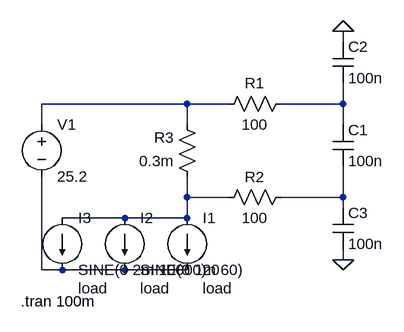
[diagram p0: schematic Draft1.asc]
Draft1.asc, the LTspice schematic file:
Version 4.1
SHEET 1 880 680
WIRE 256 0 256 -16
WIRE 16 96 -208 96
WIRE 80 96 16 96
WIRE 256 96 256 64
WIRE 256 96 160 96
WIRE -208 128 -208 96
WIRE 16 128 16 96
WIRE 256 128 256 96
WIRE 16 240 16 208
WIRE 80 240 16 240
WIRE 256 240 256 192
WIRE 256 240 160 240
WIRE 256 256 256 240
WIRE -80 272 -176 272
WIRE 16 272 16 240
WIRE 16 272 -80 272
WIRE 256 336 256 320
WIRE -208 352 -208 208
WIRE -176 352 -208 352
WIRE -80 352 -176 352
WIRE 16 352 -80 352
FLAG 256 336 0
FLAG 256 -16 0
SYMBOL res 176 80 R90
WINDOW 0 0 56 VBottom 2
WINDOW 3 32 56 VTop 2
SYMATTR InstName R1
SYMATTR Value 100
SYMBOL res 176 224 R90
WINDOW 0 0 56 VBottom 2
WINDOW 3 32 56 VTop 2
SYMATTR InstName R2
SYMATTR Value 100
SYMBOL res 32 224 R180
WINDOW 0 36 76 Left 2
WINDOW 3 36 40 Left 2
SYMATTR InstName R3
SYMATTR Value 0.3m
SYMBOL cap 240 128 R0
SYMATTR InstName C1
SYMATTR Value 100n
SYMBOL cap 240 0 R0
SYMATTR InstName C2
SYMATTR Value 100n
SYMBOL cap 240 256 R0
SYMATTR InstName C3
SYMATTR Value 100n
SYMBOL voltage -208 112 R0
WINDOW 123 0 0 Left 0
WINDOW 39 0 0 Left 0
SYMATTR InstName V1
SYMATTR Value 25.2
SYMBOL current 16 272 R0
WINDOW 123 0 0 Left 0
WINDOW 39 24 108 Left 2
SYMATTR InstName I1
SYMATTR Value 20
SYMATTR SpiceLine load
SYMBOL current -80 272 R0
WINDOW 123 0 0 Left 0
WINDOW 39 24 108 Left 2
SYMATTR InstName I2
SYMATTR Value SINE(0 1m 60)
SYMATTR SpiceLine load
SYMBOL current -176 272 R0
WINDOW 123 0 0 Left 0
WINDOW 39 24 108 Left 2
SYMATTR InstName I3
SYMATTR Value SINE(0 2m 10000)
SYMATTR SpiceLine load
TEXT -240 400 Left 2 !.tran 100m

The netlist it stands for:
* Draft1.asc
R1 N002 N001 100
R2 N004 N003 100
R3 N003 N001 0.3m
C1 N002 N004 100n
C2 0 N002 100n
C3 N004 0 100n
V1 N001 N005 25.2
I1 N003 N005 20 load
I2 N003 N005 SINE(0 1m 60) load
I3 N003 N005 SINE(0 2m 10000) load
.tran 100m
.backanno
.end